# EAGLE schematic on shore (EAGLE 6.0)
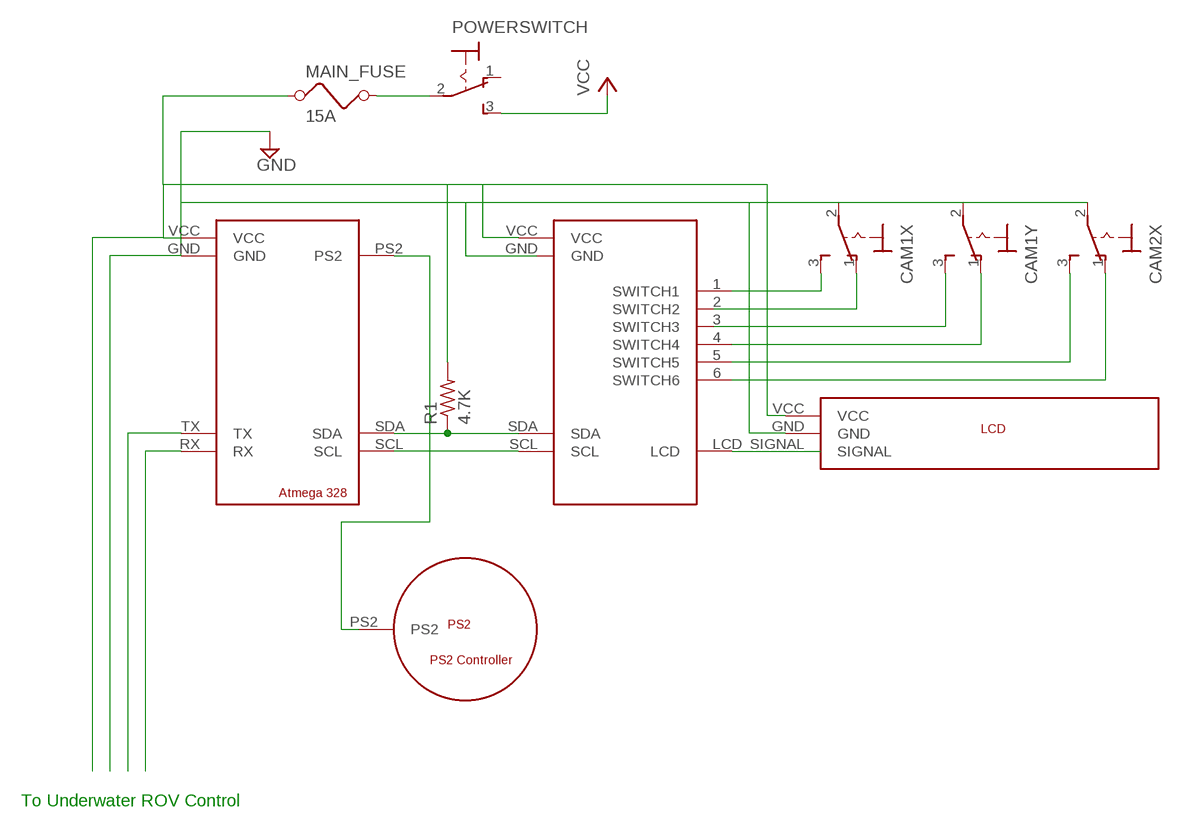
[diagram p0: schematic, sheet 1]

## Parts
CAM1X  320-916  [320-916]
CAM1Y  320-916  [320-916]
CAM2X  320-916  [320-916]
MAIN_FUSE  15A  FUSE  [FUSE]
POWERSWITCH  320-916  [320-916]
R1  4.7K  R-US_0204/7  [0204/7]
U$1  CONTROL  [CONTROL]
U$2  AUX  [AUX]
U$3  LCD  [LCD]
U$4  PS2  [PS2]

## Nets
GND: CAM2X.2(P) U$1.GND U$3.GND
N$1: U$1.TX
N$2: U$1.RX
N$3: R1.1 U$1.SDA U$2.SDA
N$4: U$1.SCL U$2.SCL
N$5: MAIN_FUSE.1 R1.2 U$1.VCC U$2.VCC U$3.VCC
N$6: MAIN_FUSE.2 POWERSWITCH.2(P)
N$7: CAM1X.3(S) U$2.1(SWITCH1)
N$8: CAM1X.1(O)
N$9: CAM1Y.3(S)
N$10: CAM1Y.1(O) U$2.4(SWITCH4)
N$11: CAM2X.3(S) U$2.5(SWITCH5)
N$12: CAM2X.1(O) U$2.6(SWITCH6)
N$13: U$2.LCD
N$14: U$1.PS2 U$4.PS2
VCC: POWERSWITCH.3(S)
Unconnected: CAM1X.2(P) CAM1Y.2(P) POWERSWITCH.1(O) U$2.2(SWITCH2) U$2.3(SWITCH3) U$2.GND U$3.SIGNAL

## Notes on the sheet
- To Underwater ROV Control

## Library data of the parts
CAM1X CAM1Y CAM2X POWERSWITCH = switch:320-916: TOGGLE SWITCH distributor RS Components
MAIN_FUSE = special:FUSE: FUSE 5 x 20 mm
R1 = resistor:R-US_: RESISTOR, American symbol
U$1 = rov:CONTROL
U$2 = rov:AUX
U$3 = rov:LCD
U$4 = rov:PS2